# Altium project GAINS.PrjPcb
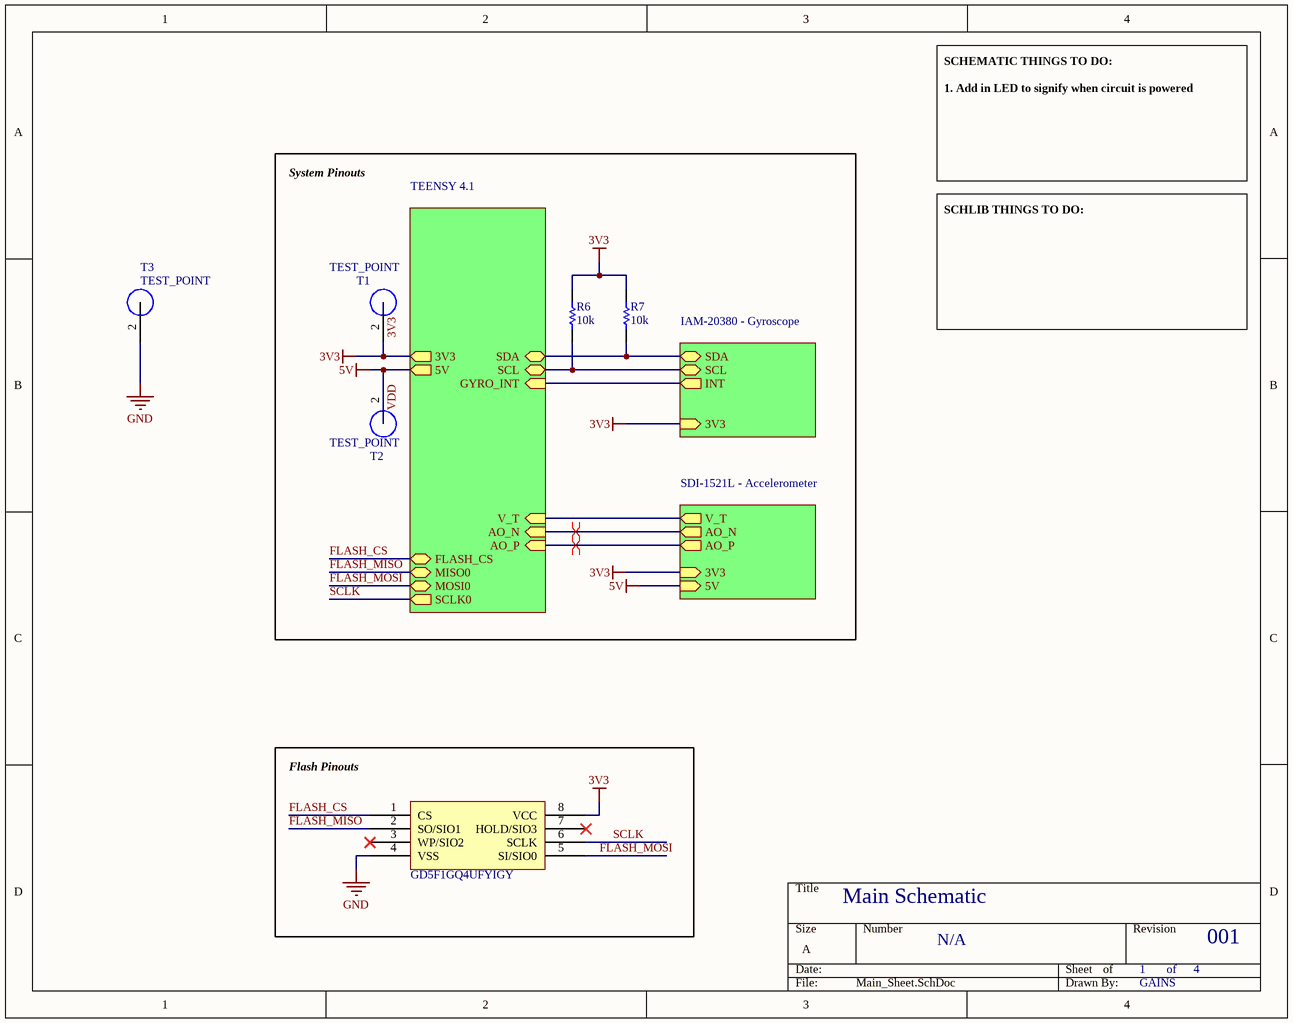
[diagram p0: Main_Sheet.SchDoc]
4 sheets, 25 parts. Net scope: hierarchical (ports join the sheet entries above them; power ports are global).
Board file: GAINS_PCB.PcbDoc
Sheets:
  Main_Sheet.SchDoc
    TEENSY 4.1 = Microcontroller.SchDoc
    SDI-1521L - Accelerometer = Accelerometer.SchDoc
    IAM-20380 - Gyroscope = Gyroscope.SchDoc

## Sheet Main_Sheet.SchDoc: Main Schematic
size A; Author: GAINS; DocumentNumber: N/A; Revision: 001; SheetNumber: 1; SheetTotal: 4

### Parts
R6  10k  [RESC2013X50X30LL20T20]
R7  10k  [RESC2013X50X30LL20T20]
T1  TEST_POINT  [PCBComponent_1]
T2  TEST_POINT  [PCBComponent_1]
T3  TEST_POINT  [PCBComponent_1]
  GD5F1GQ4UFYIGY  [SON127P800X80_HS-9N]

### Blocks framed on the sheet
System Pinouts: R6 R7 T1 T2
Flash Pinouts: 

### Sub-sheets
IAM-20380 - Gyroscope = Gyroscope.SchDoc: 3V3 (in), SCL (bidir), SDA (bidir), INT (out)
SDI-1521L - Accelerometer = Accelerometer.SchDoc: 5V (in), AO_N (out), AO_P (out), V_T (out), 3V3 (in)
TEENSY 4.1 = Microcontroller.SchDoc: 3V3 (out), SDA (bidir), SCL (bidir), 5V (out), AO_P (in), AO_N (in), V_T (in), GYRO_INT (in), FLASH_CS (bidir), MISO0 (bidir), MOSI0 (bidir), SCLK0 (out)

### Nets
3V3: R6.2 R7.2 T1.2 .8(VCC) ; sheet TEENSY 4.1/3V3, sheet SDI-1521L - Accelerometer/3V3, sheet IAM-20380 - Gyroscope/3V3
GND: .4(VSS)
VDD: T2.2 ; sheet TEENSY 4.1/5V, sheet SDI-1521L - Accelerometer/5V  [also labelled 5V]
AO_N: sheet TEENSY 4.1/AO_N, sheet SDI-1521L - Accelerometer/AO_N
AO_P: sheet TEENSY 4.1/AO_P, sheet SDI-1521L - Accelerometer/AO_P
FLASH_CS: .1(CS) ; sheet TEENSY 4.1/FLASH_CS
FLASH_MISO: .2(SO/SIO1) ; sheet TEENSY 4.1/MISO0
FLASH_MOSI: .5(SI/SIO0) ; sheet TEENSY 4.1/MOSI0
GYRO_INT: sheet TEENSY 4.1/GYRO_INT, sheet IAM-20380 - Gyroscope/INT
SCL: R6.1 ; sheet TEENSY 4.1/SCL, sheet IAM-20380 - Gyroscope/SCL
SCLK: .6(SCLK) ; sheet TEENSY 4.1/SCLK0
SDA: R7.1 ; sheet TEENSY 4.1/SDA, sheet IAM-20380 - Gyroscope/SDA
V_T: sheet TEENSY 4.1/V_T, sheet SDI-1521L - Accelerometer/V_T

Not connected (* = marked no-connect by the designer): T3 2;  3(WP/SIO2)* 7(HOLD/SIO3)*

### Layout directives
differential pair: AO_N, AO_P

### Notes on the sheet
- SCHEMATIC THINGS TO DO:
  1. Add in LED to signify when circuit is powered
- SCHLIB THINGS TO DO:
- of

### Library data of the parts
R6 R7 = CMP-2001-04257-1: CRCW080510K0JNTA; Manufacturer: Vishay Dale; Part Number: CRCW080510K0JNTA
T1-T3 = TEST_POINT: Test Point
 = GD5F1GQ4UFYIGY: FLASH - NAND Memory IC 1Gbit SPI - Quad I/O 120 MHz 8-WSON (6x8) - GD5F1GQ4UFYIGY

## Sheet Microcontroller.SchDoc: Microcontroller Schematic
size A; Author: Jason Popich; DocumentNumber: N/A; Revision: 001; SheetNumber: 2; SheetTotal: 4
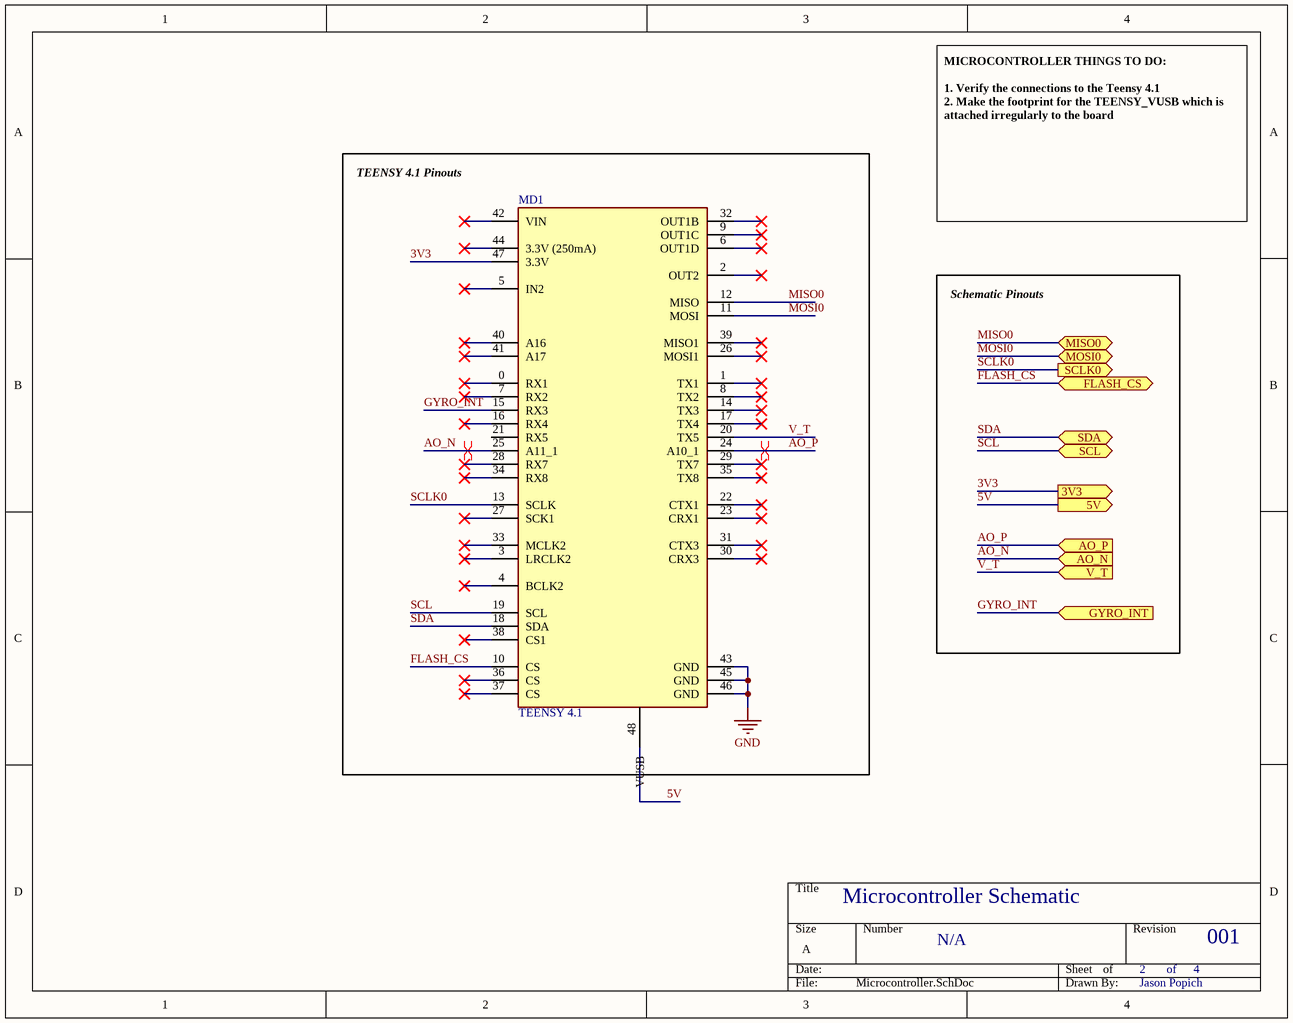
[diagram p1: Microcontroller.SchDoc]

### Parts
MD1  TEENSY 4.1  [Teensy4_1]

### Blocks framed on the sheet
TEENSY 4.1 Pinouts: MD1

### Ports
3V3 (out, see Main_Sheet[2B], Accelerometer[3B], Gyroscope[4B]), 5V (out, see Main_Sheet[2B], Accelerometer[3B]), AO_N (in, see Main_Sheet[2C], Accelerometer[3B]), AO_P (in, see Main_Sheet[2C], Accelerometer[3B]), FLASH_CS (bidir, see Main_Sheet[2C]), GYRO_INT (in, see Main_Sheet[2B]), MISO0 (bidir, see Main_Sheet[2C]), MOSI0 (bidir, see Main_Sheet[2C]), SCL (bidir, see Main_Sheet[2B], Gyroscope[4B]), SCLK0 (out, see Main_Sheet[2C]), SDA (bidir, see Main_Sheet[2B], Gyroscope[4B]), V_T (in, see Main_Sheet[2C], Accelerometer[3B])

### Nets
3V3: MD1.47(3.3V) ; port 3V3
GND: MD1.43(GND) MD1.45(GND) MD1.46(GND)
AO_N: MD1.25(A11_1) ; port AO_N
AO_P: MD1.24(A10_1) ; port AO_P
FLASH_CS: MD1.10(CS) ; port FLASH_CS
GYRO_INT: MD1.15(RX3) ; port GYRO_INT
MISO0: MD1.12(MISO) ; port MISO0  [project net FLASH_MISO]
MOSI0: MD1.11(MOSI) ; port MOSI0  [project net FLASH_MOSI]
SCL: MD1.19(SCL) ; port SCL
SCLK0: MD1.13(SCLK) ; port SCLK0  [project net SCLK]
SDA: MD1.18(SDA) ; port SDA
V_T: MD1.20(TX5) ; port V_T

Not connected (* = marked no-connect by the designer): MD1 0(RX1)* 1(TX1)* 2(OUT2)* 3(LRCLK2)* 4(BCLK2)* 5(IN2)* 6(OUT1D)* 7(RX2)* 8(TX2)* 9(OUT1C)* 14(TX3)* 16(RX4)* 17(TX4)* 21(RX5) 22(CTX1)* 23(CRX1)* 26(MOSI1)* 27(SCK1)* 28(RX7)* 29(TX7)* 30(CRX3)* 31(CTX3)* 32(OUT1B)* 33(MCLK2)* 34(RX8)* 35(TX8)* 36(CS)* 37(CS)* 38(CS1)* 39(MISO1)* 40(A16)* 41(A17)* 42(VIN)* 44(3.3V_(250mA))* 48(VUSB)

### Layout directives
differential pair: AO_N, AO_P

### Notes on the sheet
- MICROCONTROLLER THINGS TO DO:
  1. Verify the connections to the Teensy 4.1
  2. Make the footprint for the TEENSY_VUSB which is attached irregularly to the board
- Schematic Pinouts
- of

### Library data of the parts
MD1 = 080115a1ce54750370cf87ec145ee29: TEENSY 4.1 (HEADERS)

## Sheet Accelerometer.SchDoc: Accelerometer Schematic
size A; Author: Jason Popich; Engineer: Jason Popich; Organization: GAINS; DocumentNumber: N/A; Revision: 001; SheetNumber: 3; SheetTotal: 4
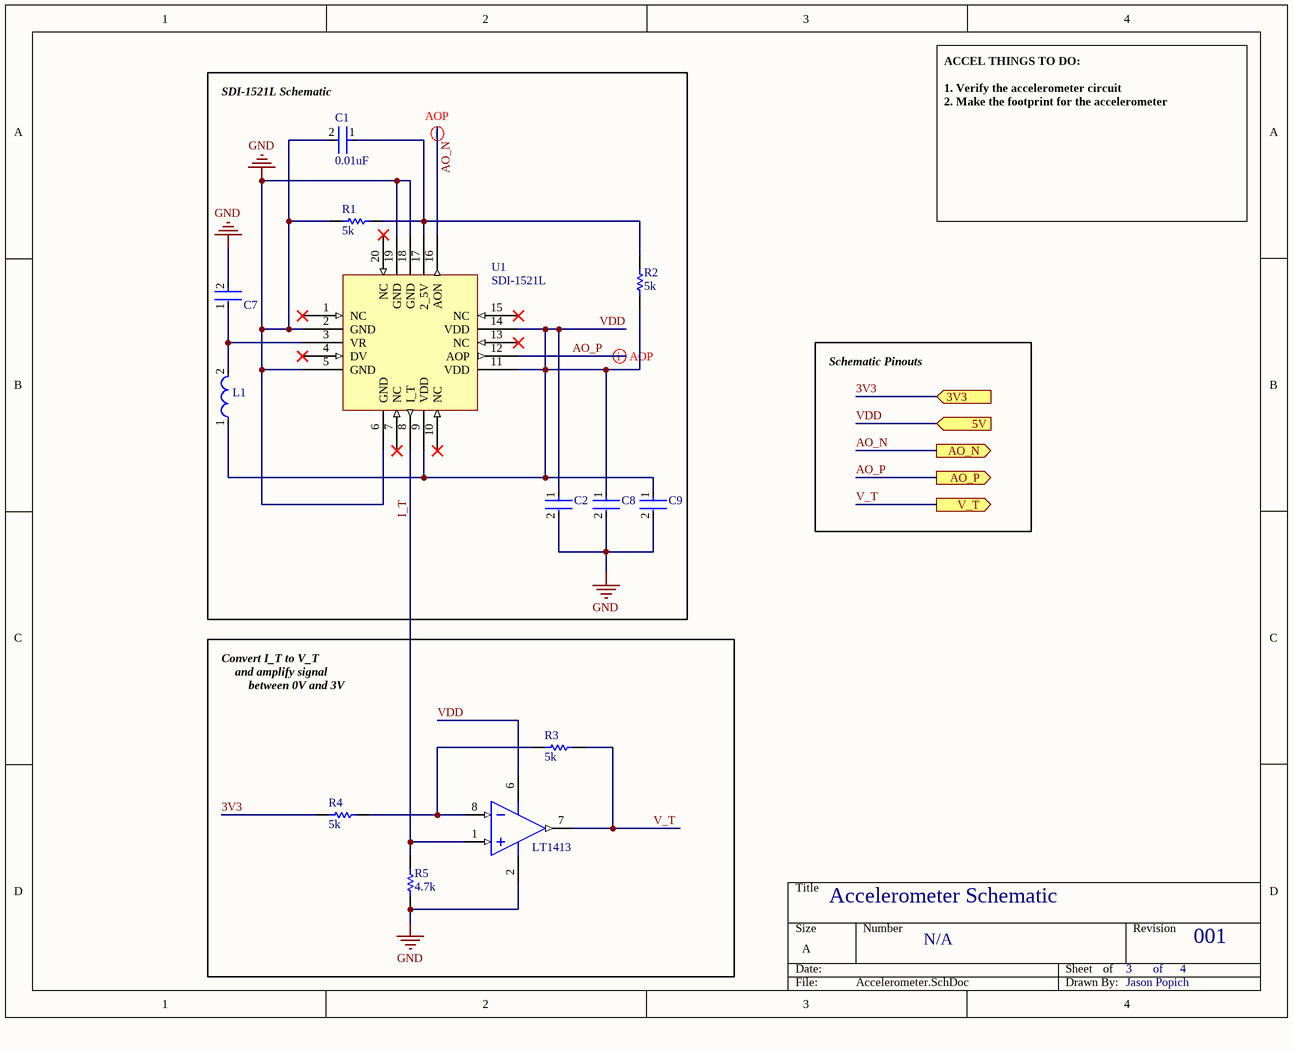
[diagram p2: Accelerometer.SchDoc]

### Parts
C1  0.01uF  [FP-GCM21B-0_15-IPC_C]
C2  GJ821BR71H105KA12L  [FP-GJ821B-0_1-MFG]  (value not drawn)
C7  KRM55QR71H106KH01K  [FP-KRM55Q-6_1_5_3_3_9_1_2-MFG]  (value not drawn)
C8  GJ821BR71H105KA12L  [FP-GJ821B-0_1-MFG]  (value not drawn)
C9  GJ821BR71H105KA12L  [FP-GJ821B-0_1-MFG]  (value not drawn)
L1  LBM2016T330J  [FP-LBM2016-1_6-0_2-IPC_B]  (value not drawn)
R1  5k  [RESC2013X50X30ML20T20]
R2  5k  [RESC2013X50X30ML20T20]
R3  5k  [RESC2013X50X30ML20T20]
R4  5k  [RESC2013X50X30ML20T20]
R5  4.7k  [RESC2013X60X30ML20T20]
U1  SDI-1521L  [SDI 1521L]
U2  LT1413  [LT-S8-8_M]  (part A of 2)

### Blocks framed on the sheet
SDI-1521L Schematic: C1 C2 C7-C9 L1 R1 R2 U1

### Ports
3V3 (in, see Main_Sheet[3C], Gyroscope[4B], Microcontroller[4B]), 5V (in, see Main_Sheet[3C], Microcontroller[4B]), AO_N (out, see Main_Sheet[3C], Microcontroller[4C]), AO_P (out, see Main_Sheet[3C], Microcontroller[4C]), V_T (out, see Main_Sheet[3C], Microcontroller[4C])

### Nets
3V3: R4.2 ; port 3V3
GND: C1.2 C2.2 C7.2 C8.2 C9.2 R1.2 R5.1 U1.2(GND) U1.5(GND) U1.6(GND) U1.18(GND) U1.19(GND) U2.2(V-)
VDD: C2.1 C8.1 C9.1 L1.1 R2.1 U1.9(VDD) U1.11(VDD) U1.14(VDD) U2.6(V+) ; port 5V
AO_N: U1.16(AON) ; port AO_N
AO_P: U1.12(AOP) ; port AO_P
I_T: R5.2 U1.8(I_T) U2.1(+IN_A)
V_T: R3.1 U2.7(OUT_A) ; port V_T
NetC1_1: C1.1 R1.1 R2.2 U1.17(2_5V)
NetC7_1: C7.1 L1.2 U1.3(VR)
NetR3_2: R3.2 R4.1 U2.8(-IN_A)

Not connected (* = marked no-connect by the designer): U1 1(NC)* 4(DV)* 7(NC)* 10(NC)* 13(NC)* 15(NC)* 20(NC)*

### Layout directives
differential pair: AO_N, AO_P

### Notes on the sheet
- ACCEL THINGS TO DO:
  1. Verify the accelerometer circuit
  2. Make the footprint for the accelerometer
- Schematic Pinouts
- Convert I_T to V_T
- and amplify signal
- between 0V and 3V
- of

### Library data of the parts
C1 = CMP-06035-043554-1: Ceramic Capacitor for Automotive 10nF ±1% 50VDC X8G 0805 Embossed T/R (GCM21B5G1H103FA16K)
C2 C8 C9 = CMP-06035-063015-1: CAP CER 1UF 50V X7R 0805; Tolerance: 10%; Dielectric: X7R; Length: 2mm; Voltage Rating (DC): 50V; Case/Package: 0805; Max Operating Temperature: 125°C; Min Operating Temperature: -55°C; Capacitance: 1uF; Depth: 1.25mm; Packaging: Tape and Reel
C7 = CMP-06035-058109-1: Cap Ceramic 10uF 50V X7R ±10% SMD 2220 +125°C Emboss T/R; ESR (Equivalent Series Resistance): 100MR; Dissipation Factor: 0.05%; Length: 0.24inch; Termination: SMD/SMT; Thickness: 0.154inch; Case/Package: SMD/SMT; Mount: Surface Mount; Voltage Rating: 50V; Height: 3.7mm; Width: 0.209inch; Package Quantity: 1; Voltage Rating (DC): 50V; Capacitance: 10uF; Min Operating Temperature: -55°C; Tolerance: 10%; Max Operating Temperature: 125°C; Packaging: Tape and Reel
L1 = CMP-14484-001407-1: SMD Inductors 33uH ±5% 0.125A 4.68Ω 0806; Test Frequency: 2.52MHz; Current Rating: 125mA; Core Material: Ferrite; DC Resistance (DCR): 3.6R; Shielding: Unshielded; Self Resonant Frequency: 15MHz; Depth: 1.8mm; Radiation Hardening: No; Series: LB; Case/Package: 0806; Case Code (Imperial): 0806; Package Quantity: 2000; Tolerance: 5%; Lead Free: Lead Free; Mount: Surface Mount; Resistor Type: Wirewound; Packaging: Tape and Reel; Termination: SMD/SMT; Max DC Current: 125mA; Inductance: 33uH; Height: 1.6mm; Height - Seated (Max): 0.071inch; Length: 2mm; DC Current: 125mA; Halogen Free: Halogen Free; Max Operating Temperature: 105°C; RoHS Compliant: Yes; Min Operating Temperature: -40°C; Width: 0.063inch; Case Code (Metric): 2016; Military Standard: Not
R1-R4 = CMP-2001-04239-1: CRCW08055K00FKTA; Manufacturer: Vishay Dale; Part Number: CRCW08055K00FKTA
R5 = CMP-2001-02407-1: RK73H2ATTD4701F; Manufacturer: KOA Speer; Part Number: RK73H2ATTD4701F
U1 = SDI1521L: SDI1521L Accelerometer +/- 2G
U2 = CMP-0359-02913-2: Dual Channel, Precision Single Supply Operational Amplifier, 0.95 MHz Typical GBW, 0.3 V/us Typical SR, 3 to 22 V, 8-Pin SOIC (S8-8), Commercial, Pb-Free, Reel; Manufacturer: Linear Technology; PartNumber: LT1413S8#TRPBF; Vos (mV) Typical: 0.05; Vs Min (V): 3; SR (V/us) Typical: 0.3; Vs Max (V): 22; Is (mA) Typical: 0.33; Channels (#): 2; GBW (MHz) Typical: 0.95; RoHS: Pb-Free; RevisionNote: URLs updated; ComponentLink2Description: Datasheet; ComponentLink3Description: Package Specification; DatasheetVersion: Rev. 0; PackageVersion: Rev G; ComponentLink2URL: http://cds.linear.com/docs/en/datasheet/lt1413.pdf; PackageDescription: 8-Pin Plastic Small Outline, Body 4.9 x 3.9 mm, Pitch 1.27 mm; ComponentLink3URL: http://cds.linear.com/docs/en/packaging/05081610_G_SO8.pdf; ComponentLink1URL: http://www.linear.com/; PackageReference: LT-S8-8; Packing: Reel; Type: VFB; Linear Technology Part Number: LT1413; ComponentLink1Description: Manufacturer URL; Mounting Technology: Surface Mount

## Sheet Gyroscope.SchDoc: Gyroscope Schematic
size A; Author: Jason Popich, Tucker Peyok, Ross White; DocumentNumber: N/A; Revision: 001; SheetNumber: 4; SheetTotal: 4
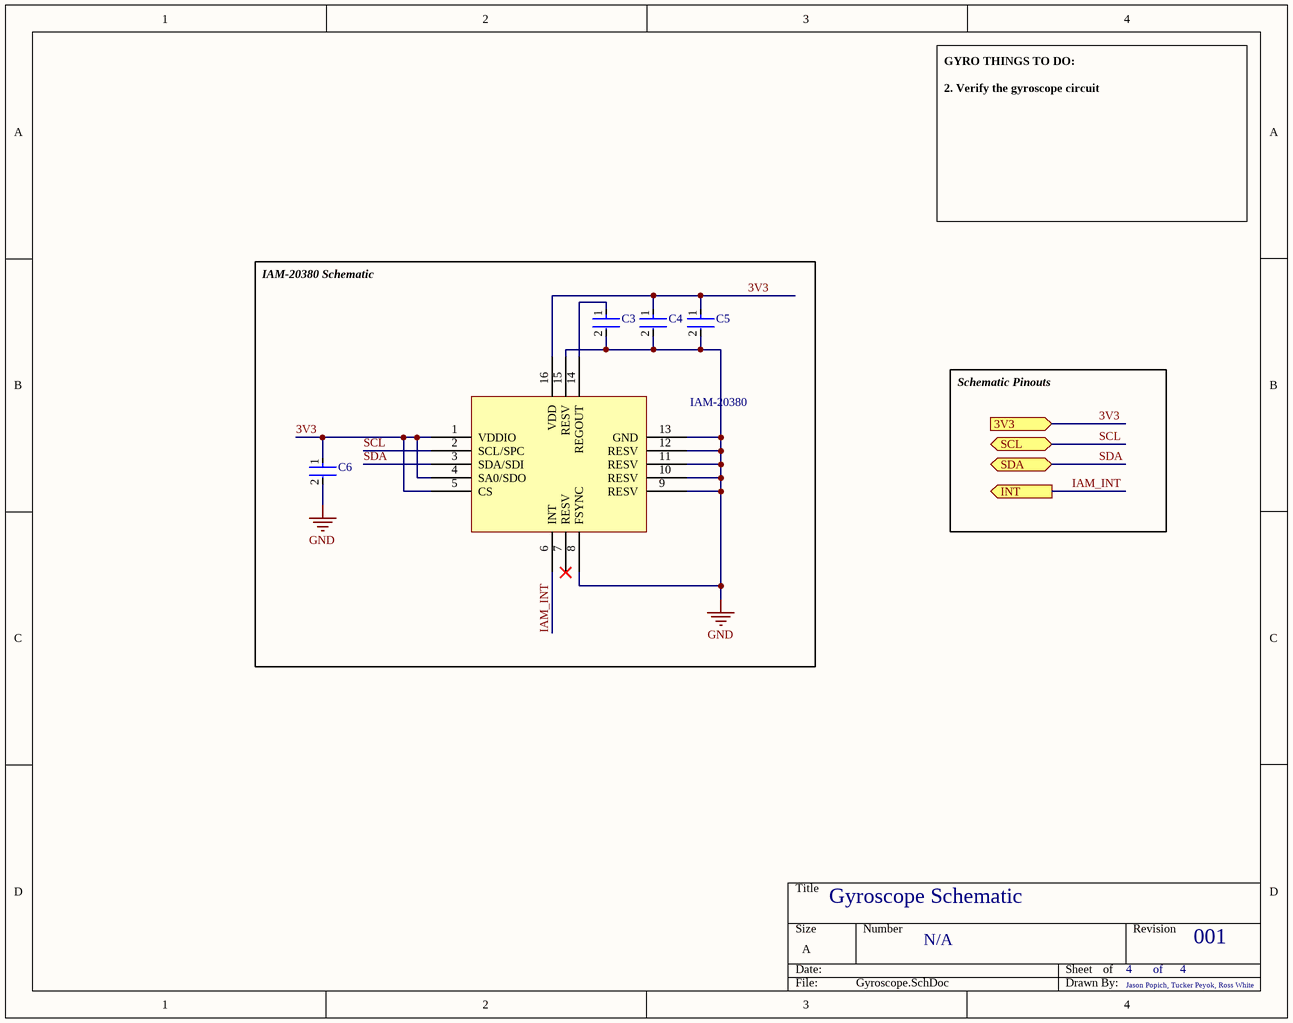
[diagram p3: Gyroscope.SchDoc]

### Parts
*  IAM-20380  [Gyro - IAM20380]
C3  GJ821BR71H105KA12L  [FP-GJ821B-0_1-MFG]  (value not drawn)
C4  GJ821BR71H105KA12L  [FP-GJ821B-0_1-MFG]  (value not drawn)
C5  GJ821BR71H105KA12L  [FP-GJ821B-0_1-MFG]  (value not drawn)
C6  GCJ21BR72E103KXJ3L  [FP-GCJ21B-0_2-MFG]  (value not drawn)

### Blocks framed on the sheet
IAM-20380 Schematic: * C3-C6

### Ports
3V3 (in, see Main_Sheet[3B], Accelerometer[3B], Microcontroller[4B]), INT (out, see Main_Sheet[3B]), SCL (bidir, see Main_Sheet[3B], Microcontroller[4B]), SDA (bidir, see Main_Sheet[3B], Microcontroller[4B])

### Nets
3V3: *.1(VDDIO) *.4(SA0/SDO) *.5(CS) *.16(VDD) C4.1 C5.1 C6.1 ; port 3V3
GND: *.8(FSYNC) *.9(RESV) *.10(RESV) *.11(RESV) *.12(RESV) *.13(GND) *.15(RESV) C3.2 C4.2 C5.2 C6.2
IAM_INT: *.6(INT) ; port INT  [project net GYRO_INT]
SCL: *.2(SCL/SPC) ; port SCL
SDA: *.3(SDA/SDI) ; port SDA
Net*_14: *.14(REGOUT) C3.1

Not connected (* = marked no-connect by the designer): * 7(RESV)*

### Notes on the sheet
- GYRO THINGS TO DO:
  2. Verify the gyroscope circuit
- Schematic Pinouts
- of

### Library data of the parts
* = IAM-20380: IAM-20380 High Performance Gyroscope
C3-C5 = CMP-06035-063015-1: CAP CER 1UF 50V X7R 0805; Tolerance: 10%; Dielectric: X7R; Length: 2mm; Voltage Rating (DC): 50V; Case/Package: 0805; Max Operating Temperature: 125°C; Min Operating Temperature: -55°C; Capacitance: 1uF; Depth: 1.25mm; Packaging: Tape and Reel
C6 = CMP-2007-03220-2: CAP CER 10000PF 250V X7R 0805; Capacitance: 10nF; Tolerance: 10%; Ratings: AEC-Q200; Width: 0.049inch; Length: 0.079inch; Voltage Rating: 250V; Min Operating Temperature: -55°C; Thickness: 0.057inch; Packaging: Tape and Reel; Case/Package: 0805; Case Code (Metric): 2012; Case Code (Imperial): 0805; Max Operating Temperature: 125°C; Voltage Rating (DC): 250V; REACH SVHC: No SVHC; Dielectric: X7R; Termination: SMD/SMT; Mount: Surface Mount; Features: Soft Termination; Package Quantity: 3000

## Nets that join several sheets
3V3: Main_Sheet (R6.2 R7.2 T1.2 .8), Microcontroller (MD1.47), Accelerometer (R4.2), Gyroscope (7 pins)
GND: Main_Sheet (.4), Microcontroller (MD1.43 MD1.45 MD1.46), Accelerometer (13 pins), Gyroscope (11 pins)
VDD: Main_Sheet (T2.2), Accelerometer (9 pins)
AO_N: Microcontroller (MD1.25), Accelerometer (U1.16)
AO_P: Microcontroller (MD1.24), Accelerometer (U1.12)
FLASH_CS: Main_Sheet (.1), Microcontroller (MD1.10)
FLASH_MISO: Main_Sheet (.2), Microcontroller (MD1.12)
FLASH_MOSI: Main_Sheet (.5), Microcontroller (MD1.11)
GYRO_INT: Microcontroller (MD1.15), Gyroscope (*.6)
SCL: Main_Sheet (R6.1), Microcontroller (MD1.19), Gyroscope (*.2)
SCLK: Main_Sheet (.6), Microcontroller (MD1.13)
SDA: Main_Sheet (R7.1), Microcontroller (MD1.18), Gyroscope (*.3)
V_T: Microcontroller (MD1.20), Accelerometer (R3.1 U2.7)